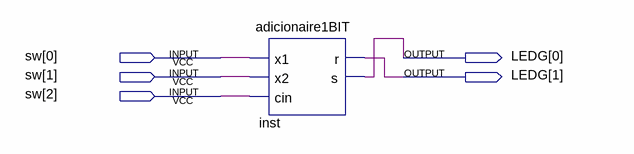
[diagram p0: schematic sheet]
// Quartus schematic BLOCK2.bdf as structural Verilog: 1 symbols, 5 pins
module BLOCK2 (
  input  [2:0] sw,
  output [1:0] LEDG
);

  adicionaire1BIT inst (.x1(sw[0]), .x2(sw[1]), .cin(sw[2]), .r(LEDG[1]), .s(LEDG[0]));
endmodule
